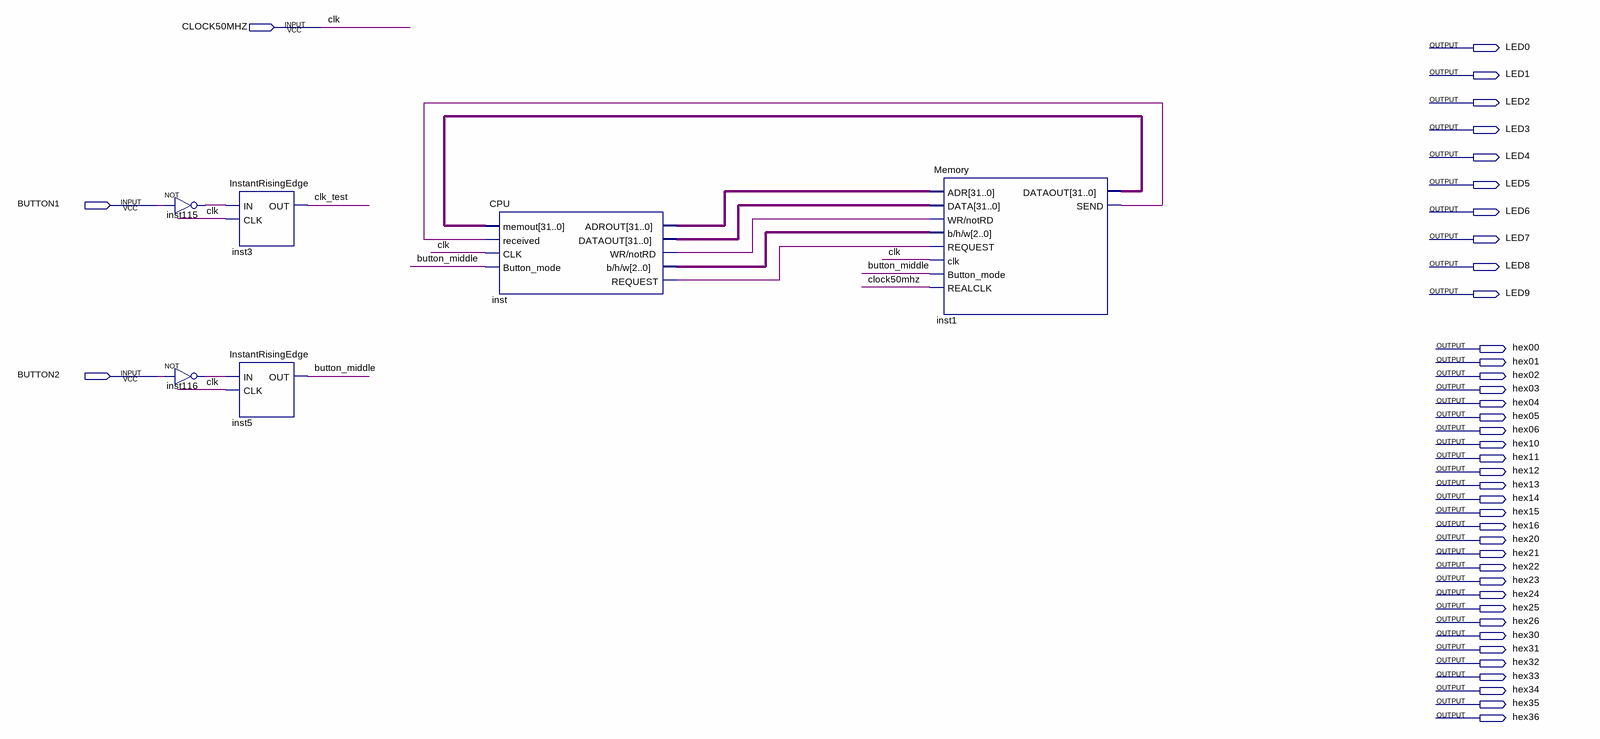
[diagram p0: schematic sheet]
// Quartus schematic MainScheme.bdf as structural Verilog: 6 symbols, 41 pins
module MainScheme (
  input  CLOCK50MHZ,
  input  BUTTON1,
  input  BUTTON2,
  output LED0,
  output LED1,
  output LED2,
  output LED3,
  output LED4,
  output LED5,
  output LED6,
  output LED7,
  output LED8,
  output LED9,
  output hex00,
  output hex01,
  output hex02,
  output hex03,
  output hex04,
  output hex05,
  output hex06,
  output hex10,
  output hex11,
  output hex12,
  output hex13,
  output hex14,
  output hex15,
  output hex16,
  output hex20,
  output hex21,
  output hex22,
  output hex23,
  output hex24,
  output hex25,
  output hex26,
  output hex30,
  output hex31,
  output hex32,
  output hex33,
  output hex34,
  output hex35,
  output hex36
);

  wire button_middle, clk_test, inst1_send, inst115_out, inst116_out, inst_request, inst_wr_notrd;
  wire [2:0] inst_b_h_w;
  wire [31:0] inst1_dataout, inst_adrout, inst_dataout;

  not inst115 (inst115_out, BUTTON1);
  not inst116 (inst116_out, BUTTON2);
  InstantRisingEdge inst3 (.IN(inst115_out), .CLK(CLOCK50MHZ), .OUT(clk_test));
  InstantRisingEdge inst5 (.IN(inst116_out), .CLK(CLOCK50MHZ), .OUT(button_middle));
  CPU inst (
    .memout(inst1_dataout), .received(inst1_send), .CLK(CLOCK50MHZ), .Button_mode(button_middle),
    .ADROUT(inst_adrout), .DATAOUT(inst_dataout), .\WR/notRD (inst_wr_notrd), .\b/h/w (inst_b_h_w),
    .REQUEST(inst_request));
  Memory inst1 (
    .ADR(inst_adrout), .DATA(inst_dataout), .\WR/notRD (inst_wr_notrd), .\b/h/w (inst_b_h_w),
    .REQUEST(inst_request), .clk(CLOCK50MHZ), .Button_mode(button_middle), .REALCLK(CLOCK50MHZ),
    .DATAOUT(inst1_dataout), .SEND(inst1_send));

  // Other names for the same wires on the sheet: clk = CLOCK50MHZ
endmodule
